# EAGLE design EAGLE (EAGLE 9.6.2)
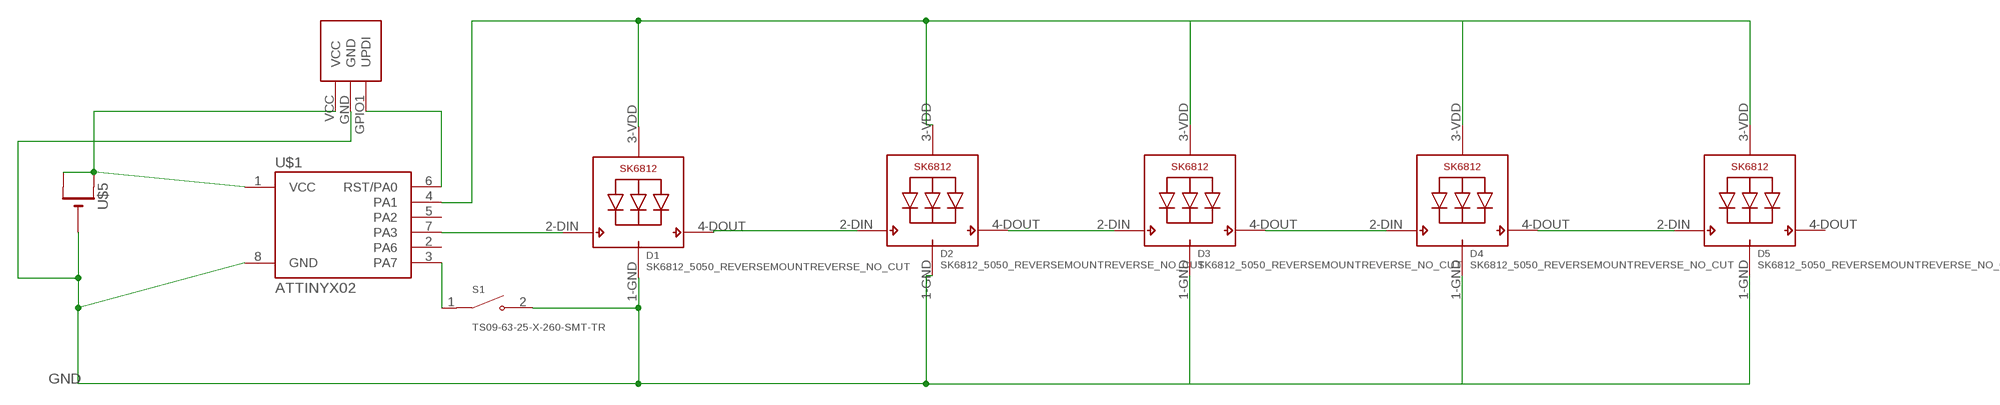
[diagram p0: schematic, sheet 1]

## Parts
D1  SK6812_5050_REVERSEMOUNTREVERSE_NO_CUT  [SK6812_REVERSE_NO_CUT]
D2  SK6812_5050_REVERSEMOUNTREVERSE_NO_CUT  [SK6812_REVERSE_NO_CUT]
D3  SK6812_5050_REVERSEMOUNTREVERSE_NO_CUT  [SK6812_REVERSE_NO_CUT]
D4  SK6812_5050_REVERSEMOUNTREVERSE_NO_CUT  [SK6812_REVERSE_NO_CUT]
D5  SK6812_5050_REVERSEMOUNTREVERSE_NO_CUT  [SK6812_REVERSE_NO_CUT]
S1  TS09-63-25-X-260-SMT-TR  [SW_TS09-63-25-X-260-SMT-TR]
U$1  ATTINYX02  [SOIC08_JEDEC_150MIL]
U$2  SAO  [SAO_SMD]
U$5  CR2032SMT  [CR2032-SMD]

## Nets
GND: D1.1-GND(GND) D2.1-GND(GND) D3.1-GND(GND) D4.1-GND(GND) D5.1-GND(GND) S1.2 U$1.8(GND) U$2.GND U$5.-
N$2: D1.4-DOUT(DO) D2.2-DIN(DI)
N$3: D1.2-DIN(DI) U$1.7(PA3)
N$5: D3.4-DOUT(DO) D4.2-DIN(DI)
N$6: D2.4-DOUT(DO) D3.2-DIN(DI)
N$7: S1.1 U$1.3(PA7)
N$8: D4.4-DOUT(DO) D5.2-DIN(DI)
N$110: U$1.6(RST/PA0) U$2.GPIO1(UPDI)
VCC1: U$1.1(VCC) U$2.VCC U$5.+$1(+) U$5.+$2(+1)
VDD1: D1.3-VDD(VDD) D2.3-VDD(VDD) D3.3-VDD(VDD) D4.3-VDD(VDD) D5.3-VDD(VDD) U$1.4(PA1)
Unconnected: D5.4-DOUT(DO) U$1.2(PA6) U$1.5(PA2)

## Library data of the parts
D1-D5 = mylibrary:SK6812_5050_REVERSEMOUNT
S1 = mylibrary:TS09-63-25-X-260-SMT-TR; MANUFACTURER: CUI Devices; MAXIMUM_PACKAGE_HEIGHT: 2.5 mm; PARTREV: 1.0; STANDARD: Manufacturer Recommendations
U$1 = mylibrary:ATTINYX02
U$2 = mylibrary:SAO
U$5 = adafruit:CR2032

## Board
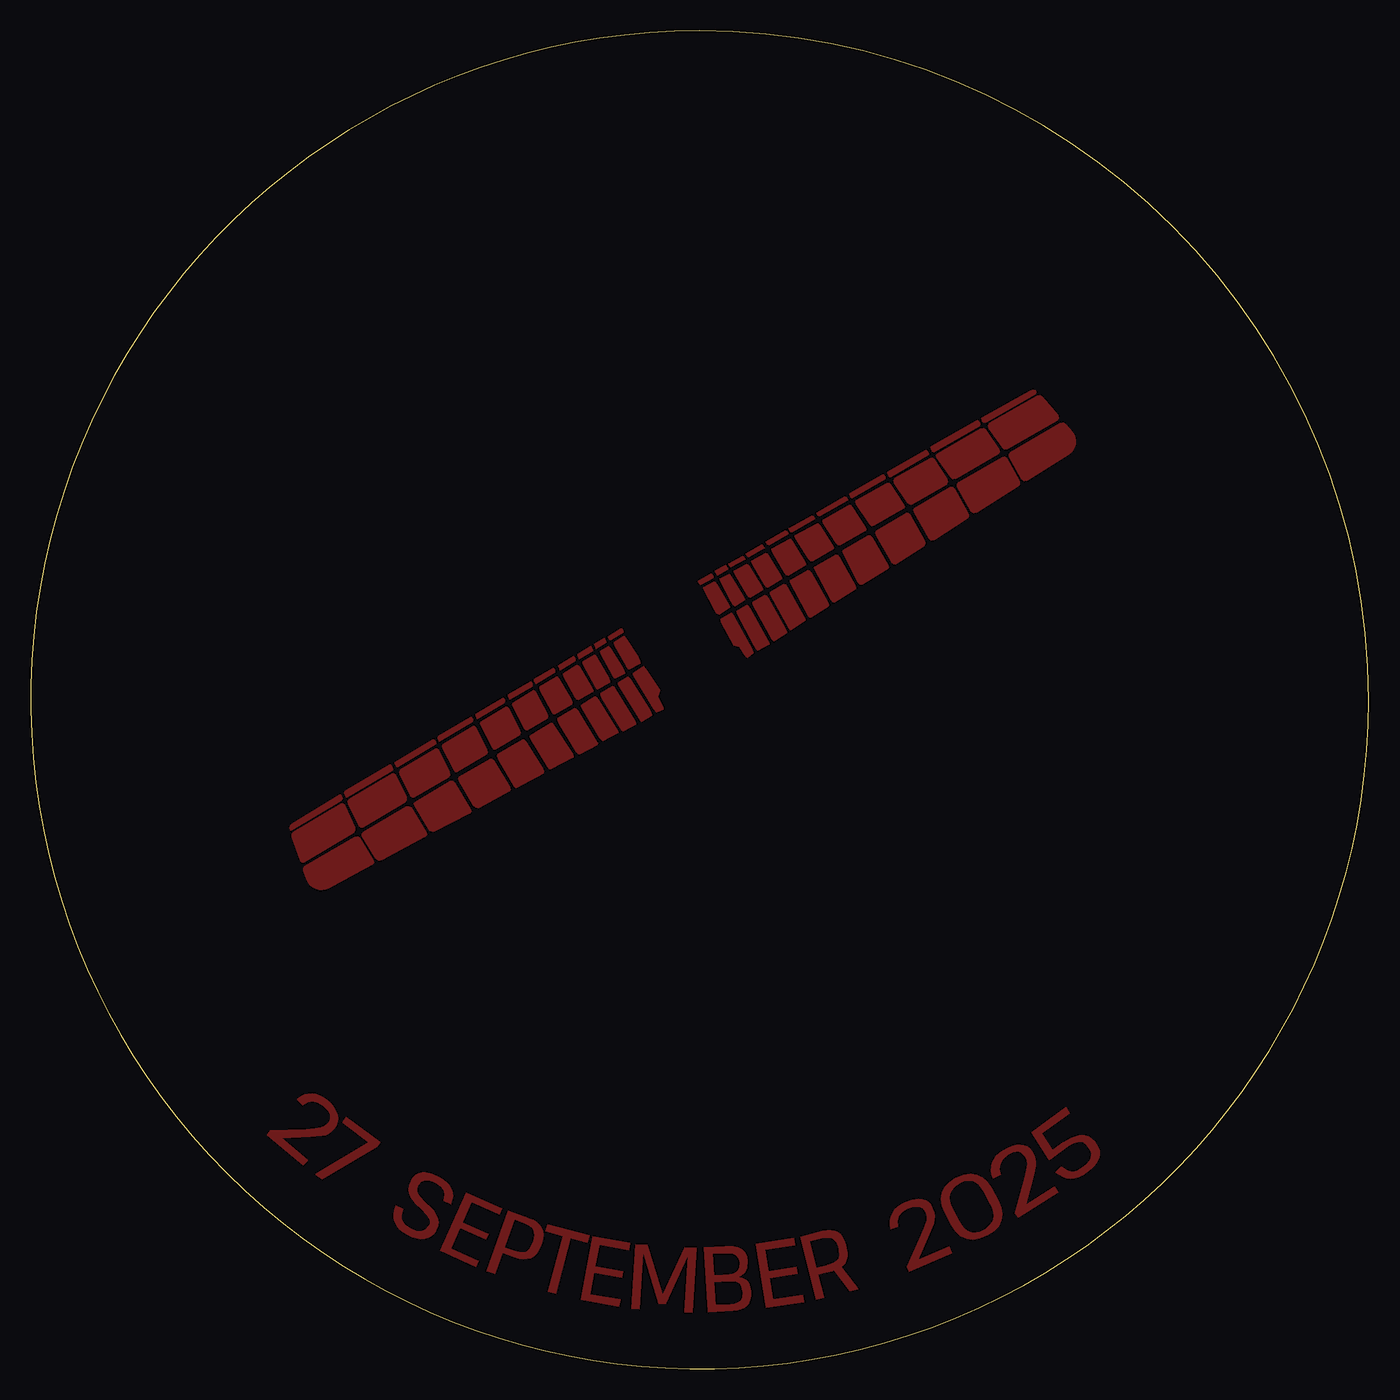
[diagram p1: board, top side]
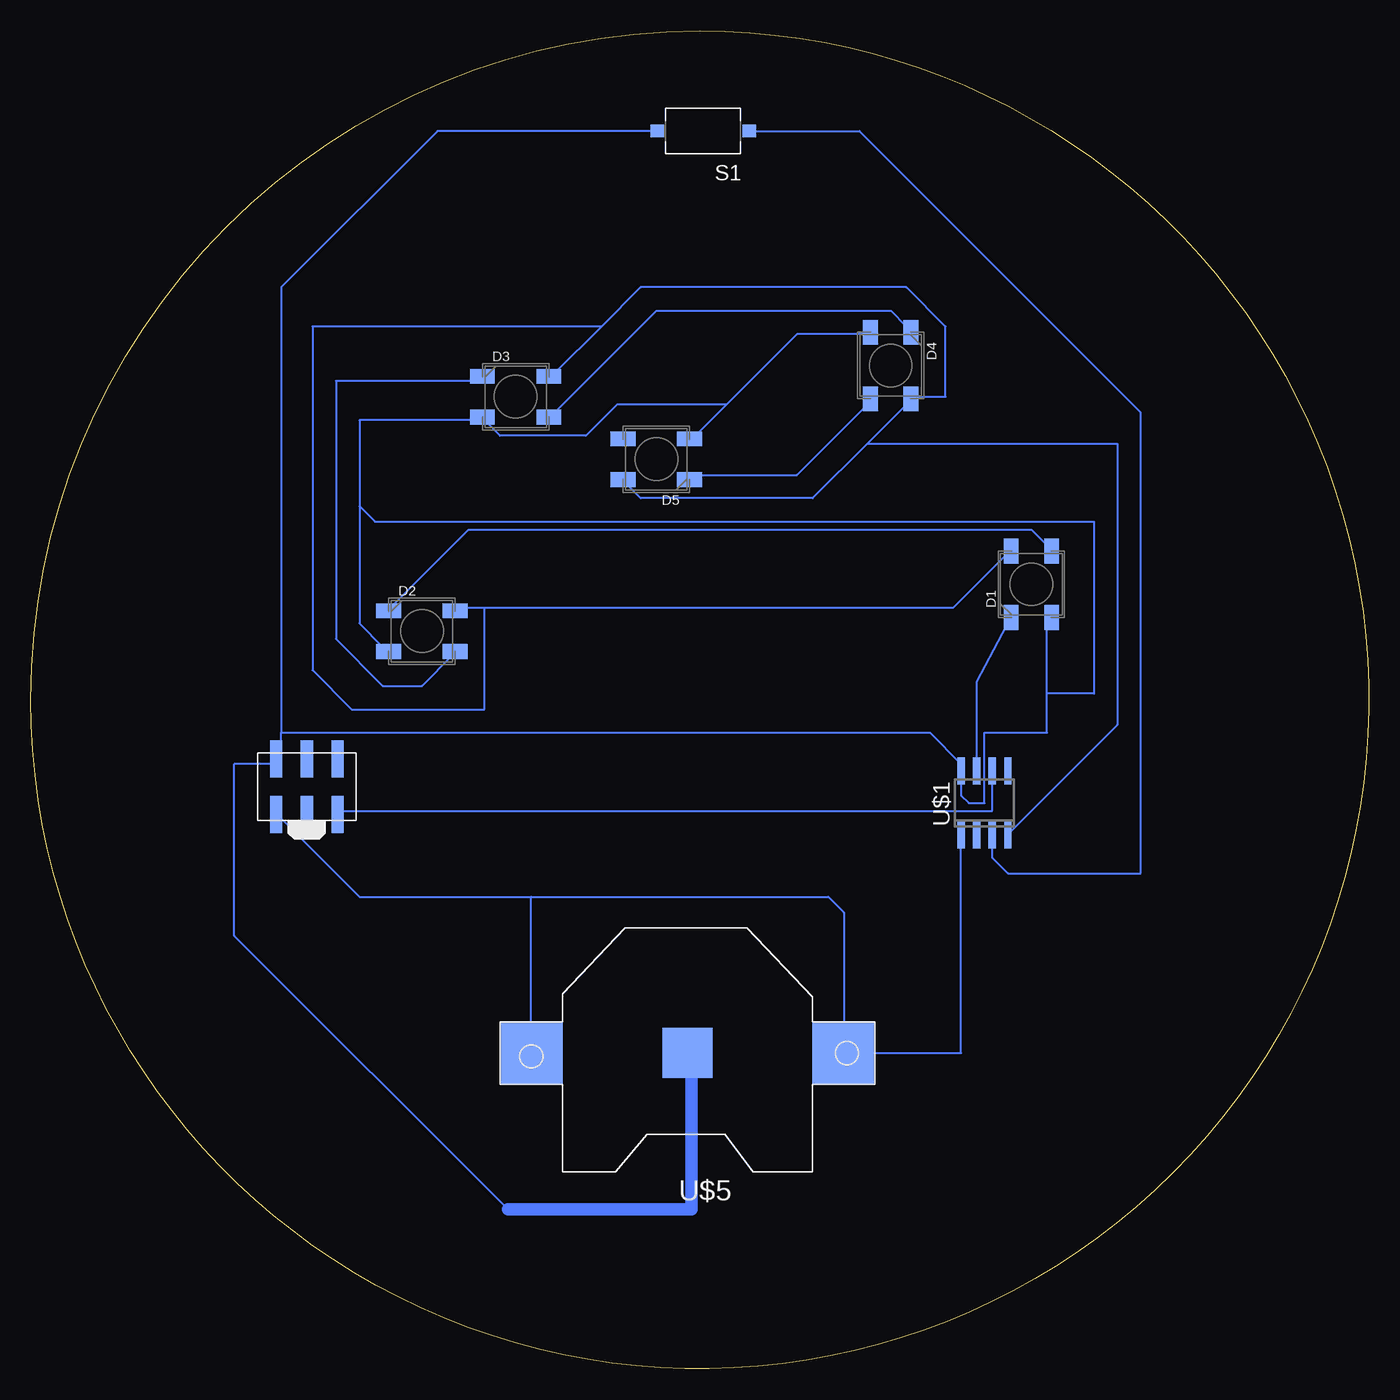
[diagram p2: board, bottom side, seen from below]

Size 108.73 x 108.73 mm. Coordinates in mm from the lower left corner, seen from the top.
Outline: 0.01,55.56 0,53.57 0.07,51.59 0.2,49.62 0.41,47.66 0.69,45.7 1.04,43.76 1.46,41.83 1.95,39.91 2.51,38.02 3.14,36.14 3.84,34.29 4.6,32.46 5.43,30.66 6.33,28.88 7.3,27.13 8.34,25.42 9.44,23.74 10.6,22.1 11.84,20.49 13.13,18.92 14.49,17.4 15.92,15.92 17.4,14.49 18.92,13.13 20.49,11.84 22.1,10.6 23.74,9.44 25.42,8.34 27.13,7.3 28.88,6.33 30.66,5.43 32.46,4.6 34.29,3.84 36.14,3.14 38.02,2.51 39.91,1.95 41.83,1.46 43.76,1.04 45.7,0.69 47.66,0.41 49.62,0.2 51.59,0.06 53.57,0 55.56,0.01 57.54,0.09 59.53,0.24 61.51,0.46 63.49,0.76 65.46,1.14 67.43,1.59 69.38,2.11 71.33,2.71 73.26,3.38 75.17,4.13 77.05,4.96 78.89,5.84 80.69,6.79 82.44,7.81 84.15,8.88 85.81,10.01 87.42,11.2 88.98,12.44 90.5,13.74 91.96,15.08 93.36,16.48 94.72,17.93 96.02,19.42 97.26,20.96 98.44,22.54 99.57,24.16 100.64,25.82 101.64,27.52 102.59,29.26 103.47,31.03 104.29,32.83 105.04,34.66 105.73,36.53 106.35,38.42 106.9,40.34 107.38,42.28 107.79,44.25 108.12,46.24 108.39,48.24 108.58,50.27 108.69,52.31 108.73,54.36 108.67,57.06 108.47,59.74 108.14,62.39 107.68,65.02 107.09,67.62 106.38,70.18 105.55,72.7 104.59,75.17 103.52,77.59 102.33,79.97 101.02,82.28 99.6,84.53 98.06,86.71 96.42,88.82 94.67,90.85 92.81,92.81 90.85,94.67 88.82,96.42 86.71,98.06 84.53,99.6 82.28,101.02 79.97,102.33 77.59,103.52 75.17,104.59 72.7,105.55 70.18,106.38 67.62,107.09 65.02,107.68 62.39,108.14 59.74,108.47 57.06,108.67 54.36,108.73 52.31,108.69 50.27,108.58 48.24,108.39 46.24,108.12 44.25,107.79 42.28,107.38 40.34,106.89 38.42,106.34 36.53,105.73 34.66,105.04 32.83,104.29 31.03,103.47 29.26,102.59 27.52,101.64 25.82,100.64 24.16,99.57 22.54,98.44 20.96,97.26 19.42,96.02 17.93,94.72 16.48,93.36 15.08,91.96 13.74,90.5 12.44,88.98 11.2,87.42 10.01,85.81 8.88,84.15 7.81,82.44 6.79,80.69 5.84,78.89 4.96,77.05 4.13,75.17 3.38,73.26 2.71,71.33 2.11,69.38 1.59,67.43 1.14,65.46 0.76,63.49 0.46,61.51 0.24,59.53 0.09,57.54 0.01,55.56
Copper layers (1*16): Top 0.035mm / dielectric 1.5mm / Bottom 0.035mm
Design rules "default": minimum track width 6mil, minimum drill 0.35mm, track to track 6mil, track to pad 6mil, pad to pad 6mil, via to via 6mil, smd to smd 6mil, copper to edge 40mil, drill to drill 6mil, minimum pad ring 10mil, minimum via ring 8mil, stop-mask expansion 4mil, vias tented up to drill 0mil, thermal gap 10mil
bRestrict: area 26.1,62.5 to 28.7,65; area 37.6,80.3 to 40.1,82.8; area 68.1,77.7 to 70.6,80.3; area 75.7,58.7 to 78.2,61.2; area 56.6,72.6 to 59.2,75.2

### Footprints (pad centres in the part's own frame; a part is rotated, then mirrored left to right if it is on the bottom)
SK6812_REVERSE_NO_CUT = smd 2 x 1.2: 1-GND -2.7,-1.65; 2-DIN -2.7,1.65; 3-VDD 2.7,1.65; 4-DOUT 2.7,-1.65
SW_TS09-63-25-X-260-SMT-TR = smd 1.1 x 1: 1 -3.75,0; 2 3.75,0
SOIC08_JEDEC_150MIL = smd 0.6 x 2.2: 1 -1.905,-2.6; 2 -0.635,-2.6; 3 0.635,-2.6; 4 1.905,-2.6; 5 1.905,2.6; 6 0.635,2.6; 7 -0.635,2.6; 8 -1.905,2.6
SAO_SMD = smd 1 x 3: GND 5.5,1.5; GPIO1 0.5,6; GPIO2 0.5,1.5; SCL 3,1.5; SDA 3,6; VCC 5.5,6
CR2032-SMD = smd 5.08 x 5.08: +$1 -12.7,0; +$2 12.7,0 | smd 4.064 x 4.064: - 0,0

### Placement (x,y rotation side)
D1  27.42,63.75 90 bottom
D2  76.95,59.94 0 bottom
D3  69.33,78.99 0 bottom
D4  38.85,81.53 270 bottom
D5  57.9,73.91 180 bottom
S1  54.09,100.58 180 bottom
U$1  31.23,45.97 0 bottom
U$2  83.3,51.05 180 bottom
U$5  55.36,25.65 180 bottom

### Tracks (layer width: path | path; a pad name or v marks a point on that pad's centre or on a via)
GND
  Bottom 0.152: 52.18,78.36 46.47,84.07 40.75,84.07 D4.1-GND | 52.18,78.36 54.72,75.82 D5.1-GND | 52.18,78.36 61.07,78.36 63.61,75.82 70.6,75.82 71.87,77.09 D3.1-GND 72.5,77.09 82.03,77.09 82.03,70.1 | 82.03,70.1 82.03,60.58 80.12,58.67 D2.1-GND | 26.15,54.86 26.15,51.69 31.23,51.69 31.23,45.97 32.5,45.97 33.13,46.61 U$1.8 33.13,49.15 35.67,51.69 88.38,51.69 | 26.15,54.86 26.15,60.58 D1.1-GND | 88.38,51.69 88.38,49.78 U$2.GND 89.01,49.15 92.19,49.15 92.19,35.18 69.96,12.95 | 82.03,70.1 80.76,68.83 22.34,68.83 22.34,54.86 26.15,54.86 | S1.2 75.68,100.58 88.38,87.88 88.38,51.69 | U$5.- 55.04,25.33
  Bottom 1.016: 55.04,25.33 55.04,12.95 69.96,12.95
N$1
  pour Top: 19.47,19.32 19.23,19.03 22.15,16.56 22.49,16.95 20.35,18.76 22.7,18.87 23.63,18.95 23.95,19.03 24.2,19.14 24.42,19.3 24.62,19.5 24.69,19.58 24.85,19.82 24.94,20.08 24.97,20.35 24.92,20.63 24.81,20.93 24.64,21.22 24.39,21.51 24.08,21.8 23.78,22.02 23.48,22.19 23.17,22.29 22.85,22.33 22.54,22.32 22.24,22.24 21.95,22.1 21.66,21.9 22.09,21.44 22.51,21.68 22.93,21.76 23.36,21.66 23.77,21.41 24.14,21.03 24.33,20.65 24.35,20.3 24.19,19.98 24.12,19.9 23.89,19.69 23.59,19.57 23.12,19.49 22.39,19.43
N$2
  Bottom 0.152: D1.4-DOUT 26.15,66.93 27.42,68.2 73.14,68.2 79.49,61.85 D2.2-DIN
N$3
  Bottom 0.152: U$1.7 31.86,55.84 D1.2-DIN
N$4
  pour Top: 27.51,18.41 23.14,15.82 23.67,15.43 28.15,18.09 28.38,18.41 25.64,20.43 25.33,20.01
N$5
  Bottom 0.152: D4.2-DIN 37.58,84.71 38.85,85.98 57.9,85.98 66.15,77.72 D3.4-DOUT
N$6
  Bottom 0.152: D2.4-DOUT 74.41,58.04 76.95,55.5 80.12,55.5 83.93,59.31 83.93,80.26 72.5,80.26 D3.2-DIN
N$7
  Bottom 0.152: U$1.3 30.59,41.53 29.32,40.26 18.53,40.26 18.53,77.72 41.39,100.58 S1.1
N$8
  Bottom 0.152: D4.4-DOUT 40.75,78.36 46.47,72.64 54.72,72.64 D5.2-DIN
N$9
  pour Top: 29.53,12.87 29.47,12.54 29.48,12.22 29.56,11.92 29.72,11.65 29.94,11.39 30.24,11.14 30.61,10.91 30.98,10.74 31.34,10.62 31.68,10.57 32,10.59 32.29,10.66 32.55,10.79 32.76,10.99 32.94,11.24 33.09,11.61 33.13,11.95 33.07,12.25 32.95,12.53 32.77,12.79 32.55,13.03 32.06,13.49 31.63,13.93 31.48,14.16 31.38,14.4 31.39,14.66 31.49,14.94 31.73,15.21 32.06,15.34 32.45,15.31 32.9,15.13 33.33,14.83 33.57,14.49 33.64,14.12 33.53,13.69 34.15,13.41 34.26,13.73 34.3,14.03 34.28,14.32 34.19,14.6 34.03,14.86 33.8,15.11 33.51,15.35 33.15,15.57 32.6,15.81 32.1,15.91 31.8,15.9 31.52,15.83 31.27,15.7 31.07,15.51 30.89,15.26 30.74,14.89 30.69,14.55 30.74,14.24 30.87,13.95 31.27,13.45 31.75,12.99 32.19,12.55 32.34,12.32 32.43,12.08 32.44,11.83 32.34,11.56 32.09,11.27 31.74,11.14 31.32,11.17 30.86,11.35 30.43,11.66 30.19,12.03 30.14,12.24 30.13,12.46 30.25,12.95 29.66,13.24
N$10
  pour Top: 36.16,8.29 33.3,9.57 35.42,14.31 38.25,13.04 38.04,12.57 35.8,13.57 35.05,11.89 37.15,10.95 36.95,10.5 34.85,11.44 34.1,9.78 36.37,8.76
N$11
  pour Top: 37.7,7.7 37.09,7.92 38.82,12.81 40.17,12.34 40.01,11.87 39.27,12.14 38.47,9.87 39.33,9.56 39.86,9.45 40.07,9.45 40.26,9.5 40.43,9.6 40.57,9.74 40.79,10.16 40.88,10.4 40.98,10.9 40.96,11.1 40.9,11.29 40.78,11.45 40.62,11.59 40.14,11.83 40.04,11.86 40.2,12.33 40.45,12.24 40.81,12.09 41.1,11.9 41.33,11.69 41.49,11.45 41.59,11.19 41.62,10.89 41.59,10.57 41.49,10.22 41.38,9.91 41.24,9.59 41.07,9.33 40.86,9.13 40.61,8.99 40.33,8.92 40.03,8.9 39.69,8.94 39.32,9.05 38.3,9.41
N$12
  pour Top: 41.98,11.69 41.85,11.19 43.24,10.82 42.04,6.31 42.67,6.14 43.87,10.65 45.26,10.28 45.4,10.79
N$13
  pour Top: 45.66,10.74 44.74,5.63 47.82,5.08 47.91,5.59 45.47,6.03 45.79,7.82 48.06,7.41 48.15,7.9 45.88,8.3 46.2,10.12 48.62,9.68 48.71,10.19
N$14
  pour Top: 49.15,10.09 48.81,4.91 49.46,4.87 49.75,9.37 49.78,9.37 51.03,5.34 51.61,5.3 53.38,9.14 53.4,9.14 53.11,4.63 53.76,4.59 54.09,9.77 53.12,9.83 51.38,6.04 51.36,6.04 50.12,10.03
N$15
  pour Top: 56.43,9.91 54.73,9.81 55.03,4.63 57.05,4.74 57.42,4.79 57.73,4.87 57.99,4.99 58.2,5.14 58.35,5.34 58.46,5.59 58.51,5.88 58.52,6.21 58.51,6.29 58.39,6.82 58.28,7.02 58.13,7.18 57.8,7.36 57.37,7.44 57.71,7.59 57.98,7.81 58.11,7.99 58.2,8.2 58.26,8.69 58.25,8.75 58.19,9.13 58.03,9.44 57.8,9.67 57.48,9.83 57.09,9.91 56.61,9.92 56.46,9.91 56.29,9.42 56.5,9.43 56.98,9.41 57.32,9.28 57.53,9.03 57.62,8.66 57.62,8.59 57.61,8.33 57.54,8.09 57.42,7.9 57.25,7.76 57.04,7.66 56.79,7.62 56.27,7.59 56.11,7.12 56.86,7.16 57.27,7.13 57.58,6.97 57.77,6.7 57.86,6.3 57.86,6.21 57.85,5.91 57.79,5.66 57.66,5.48 57.47,5.34 57.2,5.26 56.86,5.22 55.64,5.15 55.53,7.09 56.08,7.12 56.24,7.59 55.5,7.55 55.4,9.37 56.26,9.42
N$16
  pour Top: 62,10.58 58.94,10.11 59.74,4.98 62.83,5.46 62.75,5.97 60.3,5.59 60.02,7.39 62.3,7.75 62.22,8.23 59.94,7.87 59.66,9.69 62.08,10.07
N$17
  pour Top: 64.35,11.15 62.55,10.7 63.81,5.66 64.44,5.82 63.97,7.68 64.53,7.82 64.72,8.38 63.85,8.17 63.3,10.38 64.26,10.62 64.78,10.69 64.99,10.66 65.17,10.59 65.33,10.49 65.46,10.33 65.64,9.89 65.7,9.66 65.74,9.21 65.69,9.02 65.61,8.86 65.3,8.59 64.82,8.41 64.76,8.39 64.57,7.83 65.14,7.98 65.28,8.02 66.56,6.35 67.2,6.51 65.84,8.28 66.04,8.44 66.19,8.62 66.3,8.86 66.36,9.14 66.36,9.44 66.3,9.78 66.23,10.07 66.12,10.41 65.97,10.69 65.79,10.91 65.57,11.07 65.32,11.17 65.03,11.22 64.71,11.22
N$18
  pour Top: 69.82,12.05 69.81,11.72 69.87,11.38 70.46,11.56 70.43,12.04 70.56,12.45 70.83,12.79 71.25,13.05 71.75,13.2 72.17,13.21 72.5,13.07 72.71,12.79 72.75,12.69 72.83,12.39 72.81,12.06 72.67,11.61 72.4,10.93 71.2,8.27 71.35,7.92 74.86,9.43 74.66,9.91 72.09,8.8 73.04,10.96 73.38,11.82 73.45,12.14 73.46,12.42 73.42,12.69 73.33,12.96 73.29,13.05 73.14,13.31 72.96,13.51 72.73,13.65 72.45,13.73 72.14,13.77 71.62,13.7 71.03,13.5 70.7,13.33 70.42,13.13 70.19,12.9 70.01,12.64 69.88,12.36
N$19
  pour Top: 74.08,13.25 74,13.79 74.07,14.29 74.3,14.75 74.68,15.16 75.2,15.51 75.79,15.76 76.34,15.84 76.41,15.84 76.22,15.28 75.85,15.22 75.45,15.05 75.16,14.87 74.93,14.66 74.76,14.44 74.66,14.19 74.62,13.91 74.65,13.62 74.74,13.3 74.89,12.96 75.42,11.98 75.61,11.67 75.83,11.42 76.06,11.23 76.3,11.11 76.57,11.06 76.85,11.07 77.15,11.15 77.46,11.29 77.76,11.47 77.99,11.68 78.15,11.91 78.25,12.15 78.29,12.43 78.27,12.72 78.18,13.04 78.02,13.38 77.5,14.36 77.3,14.68 77.08,14.93 76.85,15.11 76.61,15.23 76.34,15.28 76.25,15.28 76.44,15.84 76.89,15.76 77.31,15.56 77.71,15.19 78.06,14.67 78.59,13.67 78.83,13.1 78.92,12.55 78.84,12.05 78.62,11.58 78.24,11.18 77.71,10.83 77.13,10.58 76.58,10.49 76.07,10.56 75.61,10.78 75.2,11.15 74.85,11.67 74.32,12.67
N$20
  pour Top: 78.12,15.81 78.07,16.13 78.09,16.44 78.17,16.74 78.3,17.03 78.49,17.29 78.74,17.54 79.04,17.76 79.41,17.97 79.76,18.11 80.09,18.2 80.41,18.21 80.69,18.17 80.94,18.07 81.16,17.9 81.34,17.67 81.39,17.59 81.53,17.33 81.61,17.07 81.65,16.8 81.63,16.48 81.43,15.57 80.83,13.29 83.19,14.79 83.47,14.35 80.24,12.3 80.04,12.61 80.8,15.44 80.96,16.15 81.02,16.62 80.99,16.94 80.86,17.23 80.81,17.32 80.56,17.56 80.21,17.65 79.8,17.58 79.32,17.34 78.96,17.03 78.74,16.64 78.68,16.22 78.79,15.75 78.23,15.47
N$21
  pour Top: 82.77,16.98 81.37,19.21 84.14,21.23 84.39,20.77 82.14,19.13 83.01,17.73 83.93,18.4 84.57,18.78 85.16,18.97 85.42,18.99 85.67,18.96 85.9,18.89 86.11,18.78 86.46,18.44 86.57,18.29 86.74,18 86.83,17.71 86.84,17.42 86.79,17.12 86.65,16.82 86.44,16.53 86.16,16.23 85.8,15.94 85.46,15.72 85.12,15.57 84.8,15.47 84.48,15.44 84.18,15.48 83.88,15.58 83.58,15.74 83.3,15.97 83.77,16.39 84.18,16.12 84.6,16.01 85.04,16.09 85.5,16.35 85.83,16.63 86.06,16.89 86.2,17.15 86.24,17.4 86.19,17.66 86.05,17.91 85.94,18.05 85.79,18.23 85.61,18.35 85.42,18.42 85.21,18.44 84.73,18.33 84.2,18.02 82.77,16.98 82.77,16.98
N$22
  pour Top: 21.09,44.12 21.01,43.93 21.07,43.8 21.22,43.8 25.23,46.19 25.34,46.35 25.27,46.54 25.17,46.63 25.1,46.64 21.25,44.26
N$23
  pour Top: 21.32,43.57 21.19,43.41 21.19,43.2 21.88,41.32 22.01,41.18 22.21,41.2 26.23,43.6 26.37,43.78 26.35,44.01 25.53,45.79 25.39,45.91 25.21,45.89
N$24
  pour Top: 22.18,40.48 22.18,40.69 22.31,40.85 26.35,43.22 26.55,43.25 26.71,43.13 27.81,41.32 27.84,41.11 27.71,40.94 24.22,39.05 23.97,38.95 23.71,38.9 23.45,38.91 23.19,38.98 22.95,39.1 22.75,39.26 22.58,39.47 22.46,39.71
N$25
  pour Top: 25.88,46.26 25.76,46.1 25.78,45.9 26.64,44.16 26.8,44.02 27,44.05 30.41,46.05 30.55,46.23 30.54,46.45 29.68,48.23 29.54,48.35 29.36,48.33 25.88,46.26
N$26
  pour Top: 25.52,46.9 25.47,46.83 25.47,46.75 25.58,46.5 25.63,46.46 25.7,46.47 29.36,48.62 29.43,48.71 29.41,48.83 29.3,49.02 29.24,49.07 29.15,49.06 25.52,46.9
N$27
  pour Top: 26.95,43.28 26.92,43.47 27.03,43.63 30.56,45.68 30.75,45.71 30.91,45.59 32.12,43.6 32.15,43.39 32.02,43.22 28.54,41.36 28.4,41.32 28.26,41.33 28.14,41.39 28.04,41.49
N$28
  pour Top: 31.22,45.74 31.17,45.93 31.26,46.08 34.13,47.75 34.29,47.75 34.45,47.62 35.72,45.5 35.77,45.29 35.67,45.13 32.82,43.65 32.7,43.62 32.58,43.65 32.46,43.72 32.37,43.84
N$29
  pour Top: 30.02,48.66 29.93,48.51 29.96,48.32 30.84,46.59 30.99,46.45 31.16,46.46 33.97,48.11 34.08,48.27 34.05,48.48 33.17,50.25 33.04,50.37 32.89,50.36 30.02,48.66
N$30
  pour Top: 29.62,49.18 29.61,49.26 29.66,49.31 29.66,49.31 32.68,51.12 32.75,51.13 32.81,51.08 32.91,50.9 32.93,50.8 32.87,50.72 29.83,48.92 29.77,48.92 29.72,48.96
N$31
  pour Top: 33.09,51.36 33.06,51.25 33.15,51.06 33.18,51.03 33.24,51.03 35.89,52.6 35.94,52.67 35.93,52.76 35.84,52.9 35.79,52.94 35.73,52.94 33.09,51.36
N$32
  pour Top: 33.5,50.73 33.42,50.6 33.46,50.42 34.36,48.69 34.5,48.54 34.65,48.54 37.04,49.95 37.13,50.09 37.09,50.31 36.19,52.06 36.07,52.19 35.93,52.19 33.5,50.73
N$33
  pour Top: 34.82,47.79 34.77,47.98 34.84,48.12 37.31,49.56 37.46,49.55 37.61,49.41 38.89,47.27 38.95,47.05 38.87,46.91 36.42,45.59 36.32,45.57 36.21,45.6 36,45.8
N$34
  pour Top: 37.94,49.93 37.9,49.81 37.96,49.61 39.29,47.36 39.39,47.25 39.49,47.23 41.68,48.41 41.73,48.55 41.65,48.76 40.25,50.94 40.1,51.09 39.96,51.11
N$35
  pour Top: 36.59,52.54 36.53,52.42 36.58,52.24 37.49,50.52 37.62,50.37 37.76,50.36 39.76,51.53 39.82,51.67 39.77,51.87 38.86,53.62 38.74,53.75 38.62,53.76 36.59,52.54
N$36
  pour Top: 36.16,53.17 36.14,53.06 36.22,52.88 36.26,52.84 36.31,52.84 38.52,54.15 38.56,54.21 38.54,54.29 38.45,54.44 38.41,54.49 38.36,54.48 36.16,53.17
N$37
  pour Top: 38.81,54.74 38.8,54.64 38.89,54.46 38.92,54.42 38.96,54.42 40.77,55.49 40.8,55.55 40.77,55.63 40.69,55.77 40.64,55.82 40.6,55.82 38.81,54.74
N$38
  pour Top: 39.16,54.08 39.12,53.97 39.18,53.79 40.1,52.08 40.23,51.93 40.35,51.91 42,52.88 42.05,53.01 41.99,53.21 41.06,54.95 40.95,55.08 40.84,55.1 39.16,54.08
N$39
  pour Top: 40.65,51.16 40.58,51.35 40.61,51.46 42.28,52.5 42.36,52.48 42.46,52.37 44.01,49.97 44.09,49.79 44.06,49.68 42.27,48.72 42.16,48.75 42.02,48.91
N$40
  pour Top: 42.81,52.84 42.79,52.73 42.88,52.53 44.31,50.17 44.46,49.99 44.58,49.94 46.07,50.74 46.08,50.8 46.04,50.9 44.46,53.44 44.31,53.62 44.2,53.66
N$41
  pour Top: 41.36,55.4 41.33,55.29 41.39,55.12 42.32,53.42 42.45,53.26 42.56,53.22 44,54.03 44.03,54.14 43.95,54.34 42.93,56.07 42.82,56.2 42.72,56.23 41.36,55.4
N$42
  pour Top: 40.92,55.99 40.92,55.9 41.01,55.73 41.04,55.69 41.07,55.68 42.62,56.6 42.61,56.73 42.53,56.87 42.49,56.91 42.45,56.92 40.92,55.99
N$43
  pour Top: 42.87,57.11 42.87,57.11 42.88,57.02 42.97,56.85 43,56.81 43.03,56.8 44.27,57.55 44.26,57.67 44.18,57.81 44.14,57.85 44.1,57.86
N$44
  pour Top: 43.35,56.24 43.28,56.41 43.29,56.5 43.29,56.5 44.39,57.18 44.48,57.15 44.58,57.01 45.6,55.28 45.68,55.09 45.67,54.99 44.5,54.34 44.41,54.38 44.29,54.54
N$45
  pour Top: 44.84,53.65 44.75,53.85 44.75,53.95 45.88,54.61 45.97,54.56 46.11,54.39 47.69,51.82 47.73,51.72 47.73,51.67 46.52,51.03 46.42,51.08 46.27,51.28
N$46
  pour Top: 47.29,55.45 46.3,54.87 46.31,54.76 46.4,54.55 47.87,52.1 48.02,51.91 48.12,51.85 49.19,52.4 49.19,52.45 49.14,52.55 47.52,55.21 47.38,55.39
N$47
  pour Top: 47.72,55.73 47.72,55.73 47.74,55.63 47.84,55.44 49.42,52.87 49.56,52.67 49.64,52.61 50.48,53.13 50.45,53.29 50.29,53.59 48.75,56.01 48.55,56.23
N$48
  pour Top: 49.81,57.05 48.93,56.52 48.95,56.42 49.05,56.23 50.62,53.65 50.84,53.39 51.43,53.61 51.41,53.76 51.26,54.08 50.97,54.63 51.12,55.1 50.01,56.82
N$49
  pour Top: 48.18,59.52 47.38,59.02 47.38,58.93 47.46,58.76 48.41,57.07 48.52,56.91 48.6,56.86 49.53,57.36 49.52,57.52 49.37,57.81 48.36,59.35 48.25,59.48
N$50
  pour Top: 46.93,58.71 46.25,58.27 46.34,58.03 47.29,56.33 47.4,56.17 47.48,56.12 48.28,56.54 48.26,56.69 48.11,56.98 47.11,58.53
N$51
  pour Top: 44.84,57.42 44.83,57.33 44.9,57.16 45.85,55.46 45.96,55.3 46.05,55.25 47.08,55.82 47.09,55.92 47.01,56.11 45.99,57.84 45.88,57.98 45.81,58.02
N$52
  pour Top: 45.51,58.69 44.42,58.03 44.42,58.03 44.43,57.94 44.52,57.77 44.55,57.73 44.58,57.72 45.68,58.38 45.66,58.49 45.58,58.64 45.54,58.68
N$53
  pour Top: 46.6,59.36 45.79,58.85 45.79,58.85 45.8,58.77 45.9,58.6 45.92,58.56 45.95,58.55 46.77,59.05 46.75,59.16 46.66,59.3 46.63,59.35
N$54
  pour Top: 46.96,59.44 46.95,59.52 46.95,59.52 47.97,60.15 48,60.14 48.04,60.1 48.12,59.95 48.14,59.84 47.11,59.22 47.08,59.23 47.05,59.27
N$55
  pour Top: 56.94,61.4 56.04,60.89 56.14,60.61 57.09,58.79 57.58,58.69 57.91,58.16 58.12,57.88 58.24,57.79 58.72,58.19 58.6,58.51 57.13,61.15 57.01,61.34
N$56
  pour Top: 54.76,63.29 54.69,63.45 54.7,63.53 55.53,63.97 55.6,63.93 55.71,63.79 56.71,62.12 56.8,61.94 56.8,61.85 55.91,61.29 55.78,61.38 55.6,61.65
N$57
  pour Top: 54.25,64.02 54.24,63.99 54.26,63.94 54.35,63.79 54.44,63.72 55.49,64.31 55.49,64.34 55.47,64.39 55.37,64.55 55.3,64.6 55.3,64.6
N$58
  pour Top: 55.61,64.82 55.61,64.8 55.63,64.74 55.72,64.6 55.8,64.52 56.64,64.99 56.64,65.02 56.62,65.06 56.52,65.23 56.46,65.28 56.46,65.28
N$59
  pour Top: 56.08,63.98 56.02,64.21 56.73,64.59 56.9,64.4 57.91,62.73 57.99,62.55 58,62.46 57.24,61.98 57.12,62.07 56.94,62.34
N$60
  pour Top: 57.47,61.3 57.37,61.59 58.22,62.06 58.3,62 58.42,61.82 59.88,59.17 59.98,58.96 59.99,58.86 59.12,58.38 58.99,58.48 58.81,58.77
N$61
  pour Top: 58.68,62.19 58.68,62.3 59.67,62.87 59.76,62.82 59.89,62.63 61.3,60.14 61.4,59.92 61.4,59.8 60.39,59.14 60.35,59.17 60.28,59.26 58.77,61.98
N$62
  pour Top: 57.24,64.61 57.17,64.77 57.17,64.86 58.17,65.4 58.25,65.36 58.37,65.22 59.38,63.56 59.46,63.38 59.45,63.28 58.45,62.66 58.36,62.7 58.24,62.87
N$63
  pour Top: 56.75,65.36 56.73,65.41 56.73,65.45 57.85,66.06 57.85,66.06 57.92,66.01 58.02,65.85 58.04,65.8 58.04,65.77 56.92,65.14 56.83,65.22
N$64
  pour Top: 58.16,66.17 58.14,66.23 58.15,66.26 59.41,66.96 59.41,66.96 59.48,66.91 59.59,66.75 59.61,66.7 59.6,66.67 58.34,65.96 58.24,66.03
N$65
  pour Top: 59.78,67.14 59.76,67.2 59.78,67.23 61.34,68.11 61.34,68.11 61.42,68.07 61.53,67.9 61.55,67.86 61.54,67.82 59.98,66.93 59.87,67
N$66
  pour Top: 61.65,68.2 61.63,68.26 61.65,68.3 63.47,69.33 63.47,69.33 63.56,69.29 63.68,69.12 63.7,69.07 63.68,69.04 61.85,67.99 61.79,68 61.73,68.06
N$67
  pour Top: 58.65,65.42 58.58,65.58 58.6,65.67 59.73,66.3 59.73,66.3 59.82,66.26 59.93,66.12 60.95,64.46 61.03,64.28 61.02,64.18 59.88,63.48 59.78,63.52 59.66,63.68
N$68
  pour Top: 60.29,66.4 60.22,66.56 60.25,66.66 61.65,67.43 61.65,67.43 61.75,67.41 61.87,67.27 62.89,65.62 62.97,65.43 62.94,65.32 61.53,64.46 61.42,64.5 61.29,64.65
N$69
  pour Top: 60.18,62.8 60.09,63.01 60.1,63.11 61.23,63.77 61.32,63.72 61.45,63.54 62.81,61.13 62.9,60.91 62.9,60.79 61.75,60.05 61.7,60.07 61.64,60.16
N$70
  pour Top: 61.82,63.78 61.74,63.99 61.76,64.1 63.15,64.91 63.26,64.87 63.39,64.69 64.73,62.29 64.82,62.07 64.8,61.94 63.37,61.04 63.32,61.06 63.25,61.15
N$71
  pour Top: 63.74,64.99 63.69,65.13 63.71,65.2 65.44,66.15 65.55,66.12 65.68,65.96 66.96,63.66 67.03,63.47 67,63.35 65.29,62.26 65.18,62.3 65.06,62.45
N$72
  pour Top: 66.07,66.21 66.01,66.41 66.06,66.54 68.08,67.71 68.21,67.69 68.35,67.54 69.65,65.28 69.7,65.13 69.67,65.03 67.56,63.71 67.42,63.73 67.28,63.91
N$73
  pour Top: 68.72,68.08 68.65,67.94 68.7,67.75 69.93,65.57 70.09,65.41 70.26,65.41 72.62,66.9 72.68,66.98 72.71,67.09 72.64,67.36 71.49,69.37 71.34,69.51 71.19,69.52
N$74
  pour Top: 71.82,69.62 71.78,69.82 71.86,69.96 74.73,71.63 74.9,71.64 75.05,71.5 76.13,69.56 76.19,69.42 76.19,69.29 76.15,69.17 76.07,69.08 73.38,67.33 73.19,67.32 73.03,67.46
N$75
  pour Top: 75.32,71.69 75.3,71.89 75.42,72.05 78.94,74.1 79.14,74.13 79.29,74.01 80.31,72.17 80.35,72.04 80.34,71.9 80.28,71.77 80.18,71.67 76.84,69.56 76.63,69.53 76.46,69.66
N$76
  pour Top: 79.54,74.14 79.51,74.33 79.63,74.49 83.69,76.84 83.89,76.88 84.08,76.77 84.61,76.15 84.76,75.93 84.85,75.68 84.9,75.42 84.88,75.15 84.82,74.9 84.69,74.66 84.53,74.46 84.32,74.29 80.95,72.19 80.73,72.16 80.56,72.29
N$77
  pour Top: 77.88,76.8 77.77,76.65 77.81,76.47 78.95,74.88 79.14,74.75 79.37,74.79 83.43,77.1 83.54,77.26 83.49,77.45 82.2,78.97 82.02,79.07 81.81,79.04
N$78
  pour Top: 77.28,77.27 77.25,77.2 77.28,77.07 77.41,76.92 77.6,76.93 81.66,79.24 81.73,79.37 81.65,79.49 81.44,79.51 81.24,79.45
N$79
  pour Top: 73.17,74.93 73.12,74.86 73.13,74.78 73.25,74.59 73.34,74.52 73.45,74.54 77.13,76.66 77.17,76.72 77.16,76.78 77,76.99 76.93,77.04 76.85,77.03 76.85,77.03
N$80
  pour Top: 73.63,74.06 73.6,74.24 73.71,74.39 77.22,76.4 77.22,76.4 77.42,76.43 77.58,76.32 78.68,74.7 78.72,74.5 78.59,74.33 75.17,72.35 74.95,72.32 74.76,72.44
N$81
  pour Top: 70.2,72.33 70.12,72.2 70.16,72.02 71.26,70.39 71.44,70.25 71.63,70.27 74.45,71.9 74.54,72.05 74.49,72.25 73.42,73.87 73.27,73.99 73.1,73.98 73.1,73.98
N$82
  pour Top: 69.64,72.88 69.6,72.82 69.62,72.74 69.72,72.57 69.8,72.5 69.89,72.51 72.96,74.28 72.99,74.33 72.98,74.39 72.84,74.59 72.77,74.63 72.7,74.62 72.7,74.62
N$83
  pour Top: 66.56,71.12 66.52,71.07 66.53,71 66.62,70.86 66.69,70.8 66.77,70.81 69.44,72.35 69.47,72.39 69.46,72.45 69.34,72.61 69.23,72.64 69.23,72.64
N$84
  pour Top: 67.09,70.28 67.04,70.45 67.11,70.58 69.58,71.98 69.58,71.98 69.73,71.98 69.87,71.85 70.93,70.22 70.99,70.03 70.91,69.89 68.51,68.5 68.34,68.5 68.18,68.64
N$85
  pour Top: 63.9,69.49 63.89,69.55 63.92,69.6 66.15,70.86 66.15,70.86 66.25,70.83 66.37,70.66 66.38,70.61 66.36,70.57 64.13,69.29 64.06,69.29 63.99,69.34
N$86
  pour Top: 64.42,68.73 64.37,68.9 64.41,69.01 66.48,70.18 66.48,70.18 66.61,70.17 66.75,70.04 67.79,68.4 67.86,68.21 67.8,68.08 65.79,66.93 65.65,66.94 65.49,67.08
N$87
  pour Top: 62.18,67.47 62.12,67.63 62.16,67.74 63.87,68.7 63.87,68.7 63.99,68.68 64.11,68.54 65.15,66.9 65.22,66.71 65.18,66.59 63.52,65.64 63.38,65.66 63.24,65.81
N$110
  Bottom 0.152: U$1.6 30.59,45.34 83.93,45.34 U$2.GPIO1
VCC1
  Bottom 0.152: U$1.1 33.13,25.65 U$5.+$1 42.66,37.08 43.93,38.35 68.06,38.35 | U$5.+$2 68.06,38.35 | U$2.VCC 88.38,44.7 82.03,38.35 68.06,38.35
VDD1
  Bottom 0.152: 71.87,61.85 73.77,61.85 D2.3-VDD | 71.87,61.85 33.77,61.85 29.32,66.29 D1.3-VDD | 40.75,75.18 37.58,78.36 D4.3-VDD 36.94,78.99 34.4,78.99 34.4,84.71 37.58,87.88 59.17,87.88 62.34,84.71 | 40.75,75.18 45.2,70.74 59.17,70.74 60.44,72.01 D5.3-VDD | 62.34,84.71 66.15,80.9 D3.3-VDD | 40.75,75.18 20.43,75.18 20.43,52.32 29.32,43.43 U$1.4 | 71.87,61.85 71.87,53.59 82.66,53.59 85.84,56.77 85.84,84.71 62.34,84.71